# EAGLE schematic induction heater (EAGLE 9.6.2)
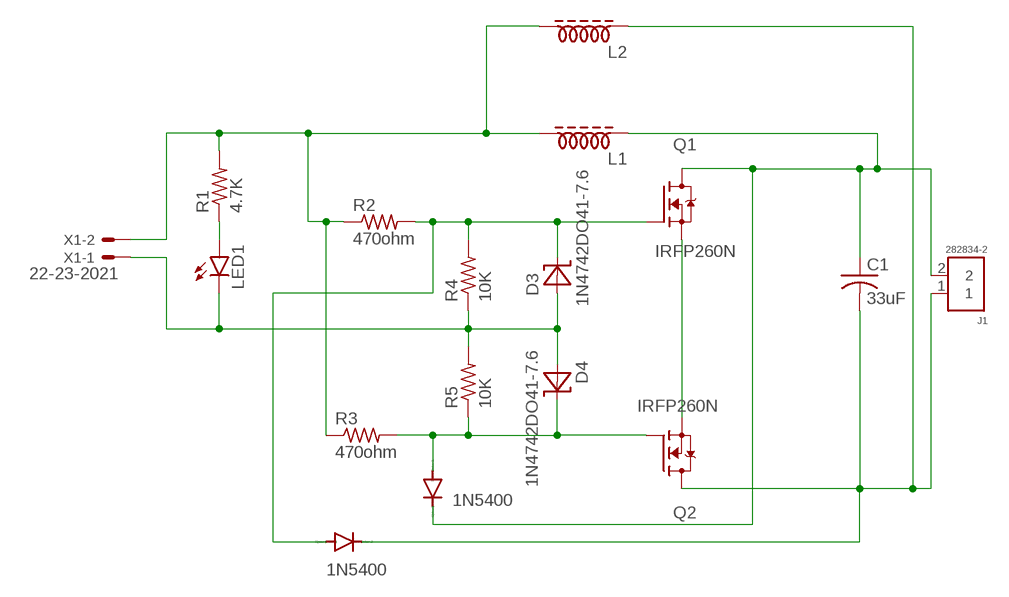
[diagram p0: schematic, sheet 1]

## Parts
C1  33uF  C-US150-054X183  [C150-054X183]
D1  1N5400  [DO201-15]
D2  1N5400  [DO201-15]
D3  1N4742DO41-7.6  [DO41-7.6]
D4  1N4742DO41-7.6  [DO41-7.6]
J1  282834-2  [CONN_282834-2]
L1  Z14/40CCW  [Z15/4]
L2  Z14/40CCW  [Z15/4]
LED1  LED5MM  [LED5MM]
Q1  IRFP260N  [TO545P1560X500X2460-3]
Q2  IRFP260N  [TO545P1560X500X2460-3]
R1  4.7K  R-US_0204/7  [0204/7]
R2  470ohm  R-US_0204/7  [0204/7]
R3  470ohm  R-US_0204/7  [0204/7]
R4  10K  R-US_0204/7  [0204/7]
R5  10K  R-US_0204/7  [0204/7]
X1  22-23-2021  [22-23-2021]

## Nets
N$1: LED1.A R1.1
N$2: D2.A D3.C Q1.1(G) R2.2 R4.2
N$3: D3.A D4.A LED1.K(C) R4.1 R5.2 X1.1
N$4: Q1.3(S) Q2.3(S)
N$6: D1.A D4.C Q2.1(G) R3.2 R5.1
N$7: C1.2 D2.C J1.1 L2.1 Q2.2(D)
N$8: L1.2 L2.2 R1.2 R2.1 R3.1 X1.2
N$10: C1.1 D1.C J1.2 L1.1 Q1.2(D)

## Library data of the parts
C1 = rcl:C-US: CAPACITOR, American symbol; SPICEPREFIX: C
D1 D2 = diode:1N5400: DIODE standard rectifier, 3 A, 50 V (Motorola)
D3 D4 = 1N4742:1N4742: 12V, 1W zener Check prices <https://pricing.snapeda.com/parts/1N4742/EIC/view-part?ref=eda>; AVAILABILITY: Warning; DESCRIPTION: Diode Zener Single 12V 10% 1000mW 2-Pin DO-41; MF: EIC; MP: 1N4742; PACKAGE: DO-41 EIC; PRICE: None
J1 = 282834-2:282834-2: Terminal block; 2.54mm; angled 90°; 0.03÷1mm2; ways: 2; 10A; H: 10mm Check prices <https://pricing.snapeda.com/parts/282834-2/TE%20Connectivity/view-part?ref=eda>; AVAILABILITY: Good; CENTERLINE_PITCH: 2.54 mm[.1 in]; COMMENT: 282834-2; DESCRIPTION: Wire-To-Board Terminal Block, 2, 150 V, 10 A, 30 Awg, 16 Awg, 1.4 Mm; EU_ROHS_COMPLIANCE: Compliant with Exemptions; MF: TE Connectivity; MP: 282834-2; NUMBER_OF_POSITIONS: 2; PACKAGE: None; PRICE: None; PURCHASE-URL: https://pricing.snapeda.com/search/part/282834-2/?ref=eda
L1 L2 = inductor-neosid:Z?CCW: CHOKE free-suspension choke/nominal inductance winding counter clockwise; OC_FARNELL: unknown; OC_NEWARK: unknown
LED1 = led:LED: LED OSRAM: - CHIPLED LG R971, LG N971, LY N971, LG Q971, LY Q971, LO R971, LY R971 LH N974, LH R974 LS Q976, LO Q976, LY Q976 LO Q996 - Hyper CHIPLED LW Q18S LB Q993, LB Q99A, LB R99A - SideLED LS A670, LO A670, LY A670, LG A670, LP A670 LB A673, LV A673, LT A673, LW A673 LH A674 LY A675 LS A676, LA A676, LO A676, LY A676, LW A676 LS A679, LY A679, LG A679 - Hyper Micro SIDELED® LS Y876, LA Y876, LO Y876, LY Y876 LT Y87S - SmartLED LW L88C, LW L88S LB L89C, LB L89S, LG L890 LS L89K, LO L89K, LY L89K LS L896, LA L896, LO L896, LY L896 - TOPLED LS T670, LO T670, LY T670, LG T670, LP T670 LSG T670, LSP T670, LSY T670, LOP T670, LYG T670 LG T671, LOG T671, LSG T671 LB T673, LV T673, LT T673, LW T673 LH T674 LS T676, LA T676, LO T676, LY T676, LB T676, LH T676, LSB T676, LW T676 LB T67C, LV T67C, LT T67C, LS T67K, LO T67K, LY T67K, LW E67C LS E67B, LA E67B, LO E67B, LY E67B, LB E67C, LV E67C, LT E67C LW T67C LS T679, LY T679, LG T679 LS T770, LO T770, LY T770, LG T770, LP T770 LB T773, LV T773, LT T773, LW T773 LH T774 LS E675, LA E675, LY E675, LS T675 LS T776, LA T776, LO T776, LY T776, LB T776 LHGB T686 LT T68C, LB T68C - Hyper Mini TOPLED® LB M676 - Mini TOPLED Santana® LG M470 LS M47K, LO M47K, LY M47K Source: http://www.osram.convergy.de LUXEON: - LUMILED® LXK2-PW12-R00, LXK2-PW12-S00, LXK2-PW14-U00, LXK2-PW14-V00 LXK2-PM12-R00, LXK2-PM12-S00, LXK2-PM14-U00 LXK2-PE12-Q00, LXK2-PE12-R00, LXK2-PE12-S00, LXK2-PE14-T00, LXK2-PE14-U00 LXK2-PB12-K00, LXK2-PB12-L00, LXK2-PB12-M00, LXK2-PB14-N00, LXK2-PB14-P00, LXK2-PB14-Q00 LXK2-PR12-L00, LXK2-PR12-M00, LXK2-PR14-Q00, LXK2-PR14-R00 LXK2-PD12-Q00, LXK2-PD12-R00, LXK2-PD12-S00 LXK2-PH12-R00, LXK2-PH12-S00 LXK2-PL12-P00, LXK2-PL12-Q00, LXK2-PL12-R00 Source: www.luxeon.com KINGBRIGHT: KA-3528ASYC Source: www.kingbright.com
Q1 Q2 = IRFP260N:IRFP260N: N-Channel 200V 50A (Tc) 300W (Tc) Through Hole TO-247AC; AVAILABILITY: Unavailable; DESCRIPTION: N-Channel 200V 50A (Tc) 300W (Tc) Through Hole TO-247AC; MF: Infineon Technologies; MP: IRFP260N; PACKAGE: TO-247-3 Infineon Technologies; PRICE: None
R1-R5 = rcl:R-US_: RESISTOR, American symbol; SPICEPREFIX: R
X1 = con-molex:22-23-2021: .100" (2.54mm) Center Header - 2 Pin; MF: MOLEX; MPN: 22-23-2021; OC_FARNELL: 1462926; OC_NEWARK: 25C3832